# EAGLE schematic Main_Board_Rev_A2 (EAGLE 7.7.0)

## Sheet 1 of 6: Ethernet&CAN
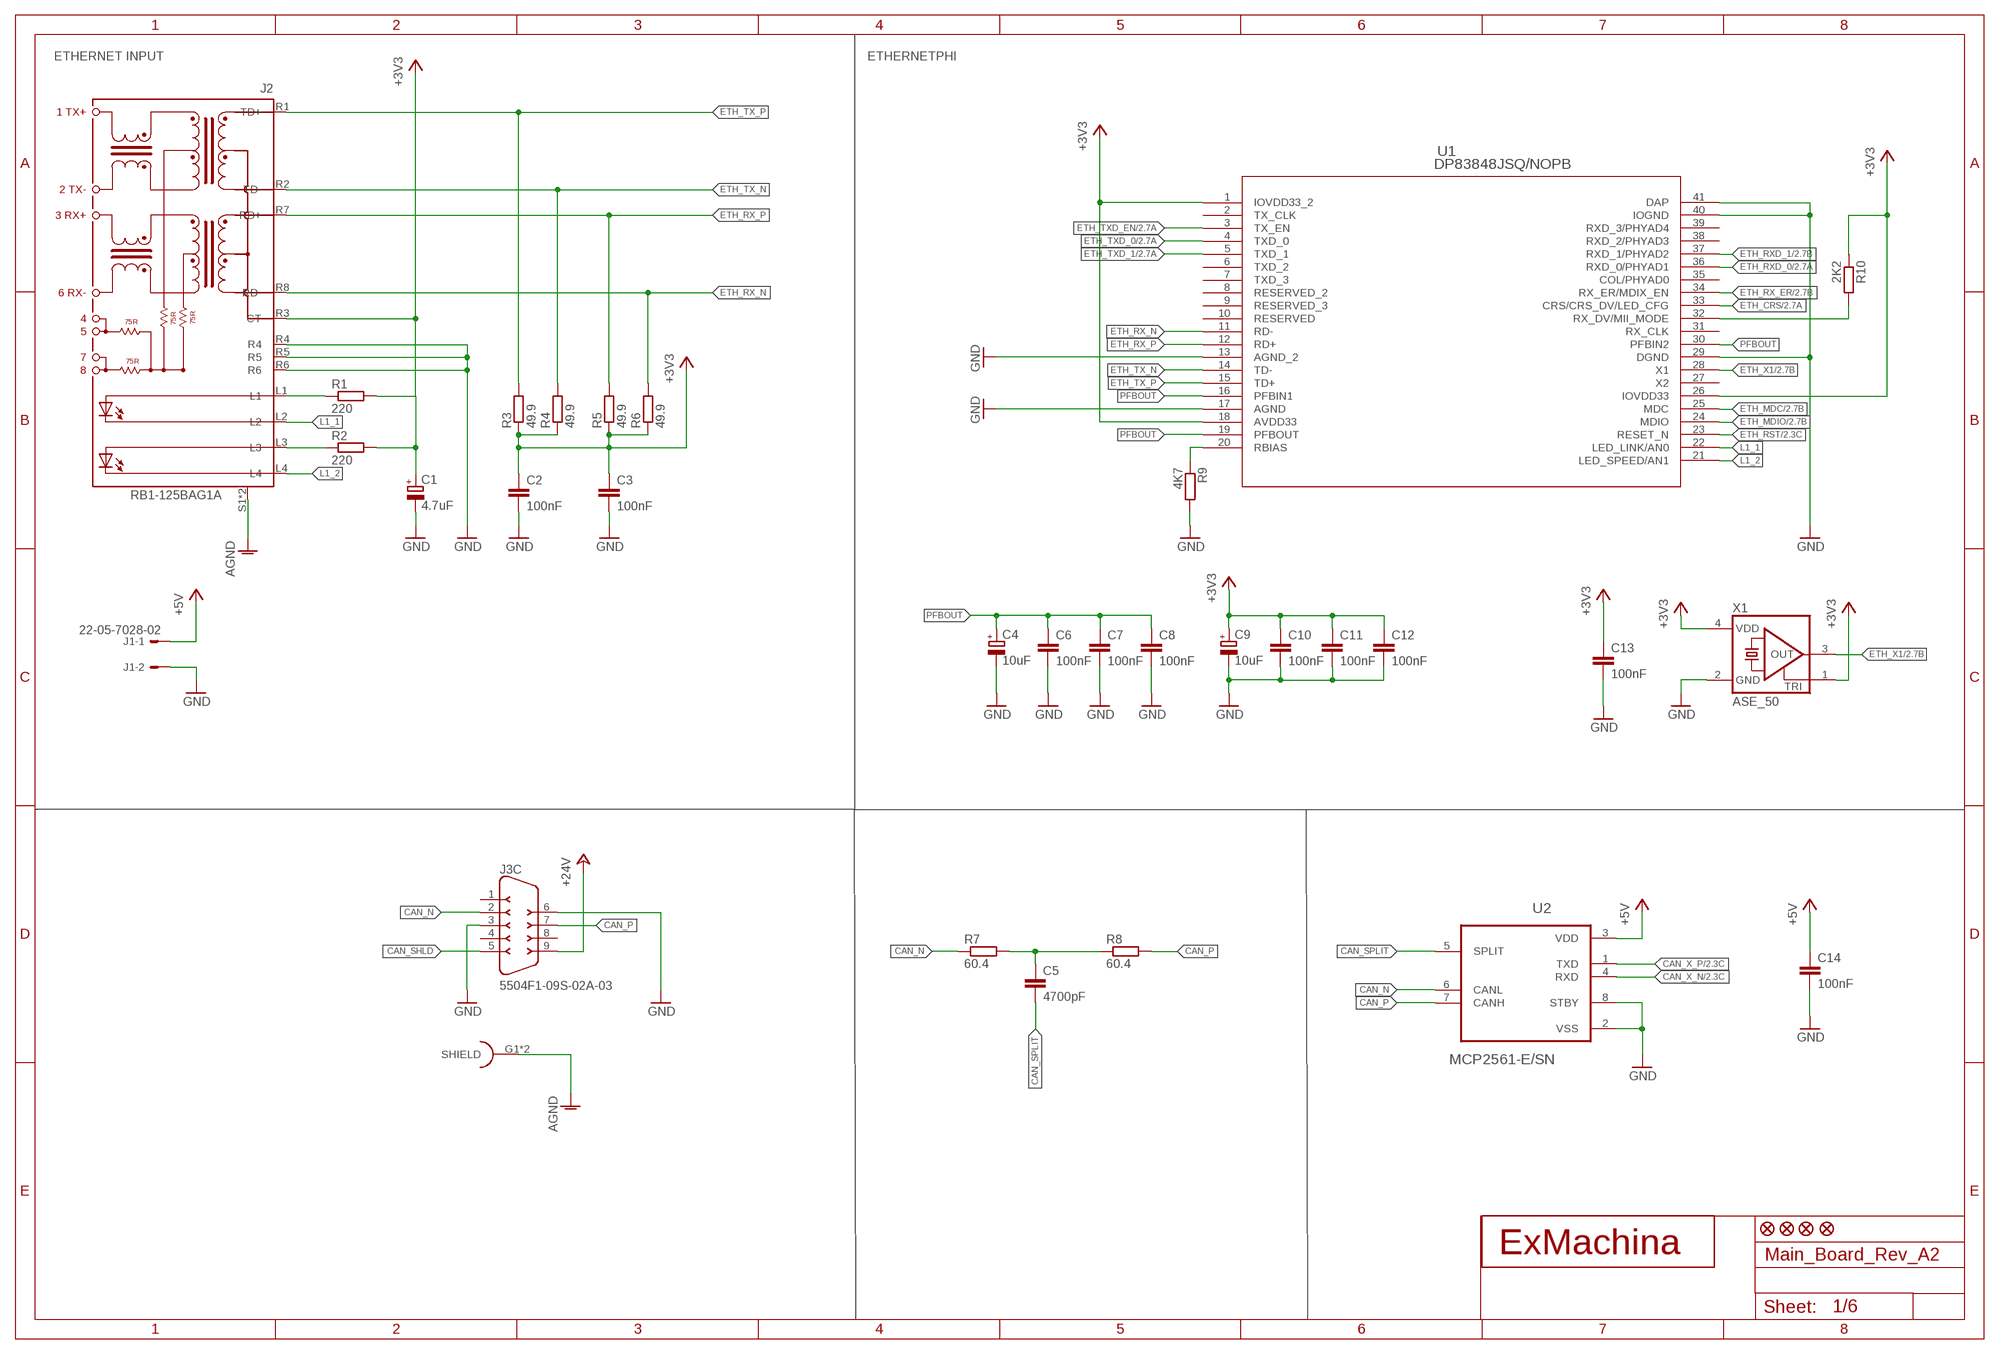
[diagram p0: schematic, sheet 1]

### Parts
C1  4.7uF  CPOL-EUCT3216  [CT3216]
C2  100nF  C-EUC0603  [C0603]
C3  100nF  C-EUC0603  [C0603]
C4  10uF  CPOL-EUCT3216  [CT3216]
C5  4700pF  C-EUC0603  [C0603]
C6  100nF  C-EUC0603  [C0603]
C7  100nF  C-EUC0603  [C0603]
C8  100nF  C-EUC0603  [C0603]
C9  10uF  CPOL-EUCT3216  [CT3216]
C10  100nF  C-EUC0603  [C0603]
C11  100nF  C-EUC0603  [C0603]
C12  100nF  C-EUC0603  [C0603]
C13  100nF  C-EUC0603  [C0603]
C14  100nF  C-EUC0603  [C0603]
J1  22-05-7028-02  [7395-02]
J2  RB1-125BAG1A  [WIZNET_RB1-125BAG1A]
J3  5504F1-09S-02A-03  [5504F1-09S-02A]
JP1  FIDUCIAL1X2  [FIDUCIAL-1X2]
JP2  FIDUCIAL1X2  [FIDUCIAL-1X2]
JP3  FIDUCIAL1X2  [FIDUCIAL-1X2]
JP4  FIDUCIAL1X2  [FIDUCIAL-1X2]
R1  220  R-EU_R0603  [R0603]
R2  220  R-EU_R0603  [R0603]
R3  49.9  R-EU_R0603  [R0603]
R4  49.9  R-EU_R0603  [R0603]
R5  49.9  R-EU_R0603  [R0603]
R6  49.9  R-EU_R0603  [R0603]
R7  60.4  R-EU_R0603  [R0603]
R8  60.4  R-EU_R0603  [R0603]
R9  4K7  R-EU_R0603  [R0603]
R10  2K2  R-EU_R0603  [R0603]
T1  EXMACHINA-LOGO-NAME  [EXM-LOGO-BASELINE]
U1  DP83848JSQ/NOPB  [SQA40B]
U2  MCP2561-E/SN  [SOIC127P600X175-8N]
X1  ASE_50  ASE  [ASE]

### Nets
+3V3 [supply]: C1.+ C2.1 C3.1 C9.+ C10.1 C11.1 C12.1 C13.1 J2.R3(CT) R1.2 R2.2 R3.1 R4.1 R5.1 R6.1 R10.1 U1.1(IOVDD33_2) U1.18(AVDD33) U1.26(IOVDD33) X1.1(TRI) X1.4(VDD) ; also sheet 2,3,4,5,6
+5V [supply]: C14.1 J1.1 U2.3(VDD) ; also sheet 3,4,5
+24V: J3.9 ; also sheet 3,5
AGND: J2.S1 J2.S2 J3.G1(S:SHIELD) J3.G2(S:SHIELD) ; also sheet 3,5,6
CAN_N [signal]: J3.2 R7.1 U2.6(CANL)
CAN_P [signal]: J3.7 R8.2 U2.7(CANH)
CAN_SHLD: J3.5
CAN_SPLIT [signal]: C5.2 U2.5(SPLIT)
CAN_X_N [signal]: U2.4(RXD) ; also sheet 2
CAN_X_P [signal]: U2.1(TXD) ; also sheet 2
ETH_CRS [signal]: U1.33(CRS/CRS_DV/LED_CFG) ; also sheet 2
ETH_MDC [signal]: U1.25(MDC) ; also sheet 2
ETH_MDIO [signal]: U1.24(MDIO) ; also sheet 2
ETH_RST [signal]: U1.23(RESET_N) ; also sheet 2
ETH_RX_ER [signal]: U1.34(RX_ER/MDIX_EN) ; also sheet 2
ETH_RX_N [signal]: J2.R8(RD-) R6.2 U1.11(RD-)
ETH_RX_P [signal]: J2.R7(RD+) R5.2 U1.12(RD+)
ETH_RXD_0 [signal]: U1.36(RXD_0/PHYAD1) ; also sheet 2
ETH_RXD_1 [signal]: U1.37(RXD_1/PHYAD2) ; also sheet 2
ETH_TX_N [signal]: J2.R2(TD-) R4.2 U1.14(TD-)
ETH_TX_P [signal]: J2.R1(TD+) R3.2 U1.15(TD+)
ETH_TXD_0 [signal]: U1.4(TXD_0) ; also sheet 2
ETH_TXD_1 [signal]: U1.5(TXD_1) ; also sheet 2
ETH_TXD_EN [signal]: U1.3(TX_EN) ; also sheet 2
ETH_X1 [signal]: U1.28(X1) X1.3(OUT) ; also sheet 2
GND [supply]: C1.- C2.2 C3.2 C4.- C6.2 C7.2 C8.2 C9.- C10.2 C11.2 C12.2 C13.2 C14.2 J1.2 J2.R4 J2.R5 J2.R6 J3.3 J3.6 R9.2 U1.13(AGND_2) U1.17(AGND) U1.29(DGND) U1.40(IOGND) U1.41(DAP) U2.2(VSS) U2.8(STBY) X1.2(GND) ; also sheet 2,3,4,5,6
L1_1 [signal]: J2.L2 U1.22(LED_LINK/AN0)
L1_2 [signal]: J2.L4 U1.21(LED_SPEED/AN1)
MII_MODE [signal]: R10.2 U1.32(RX_DV/MII_MODE)
N$3: C5.1 R7.2 R8.1
N$4: R9.1 U1.20(RBIAS)
N$8 [signal]: J2.L1 R1.1
N$9 [signal]: J2.L3 R2.1
PFBOUT [signal]: C4.+ C6.1 C7.1 C8.1 U1.16(PFBIN1) U1.19(PFBOUT) U1.30(PFBIN2)
Unconnected: J3.1 J3.4 J3.8 U1.2(TX_CLK) U1.6(TXD_2) U1.7(TXD_3) U1.8(RESERVED_2) U1.9(RESERVED_3) U1.10(RESERVED) U1.27(X2) U1.31(RX_CLK) U1.35(COL/PHYAD0) U1.38(RXD_2/PHYAD3) U1.39(RXD_3/PHYAD4)

### Notes on the sheet
- ETHERNET INPUT | ETHERNETPHI

## Sheet 2 of 6: LPC1768 + EEPROM
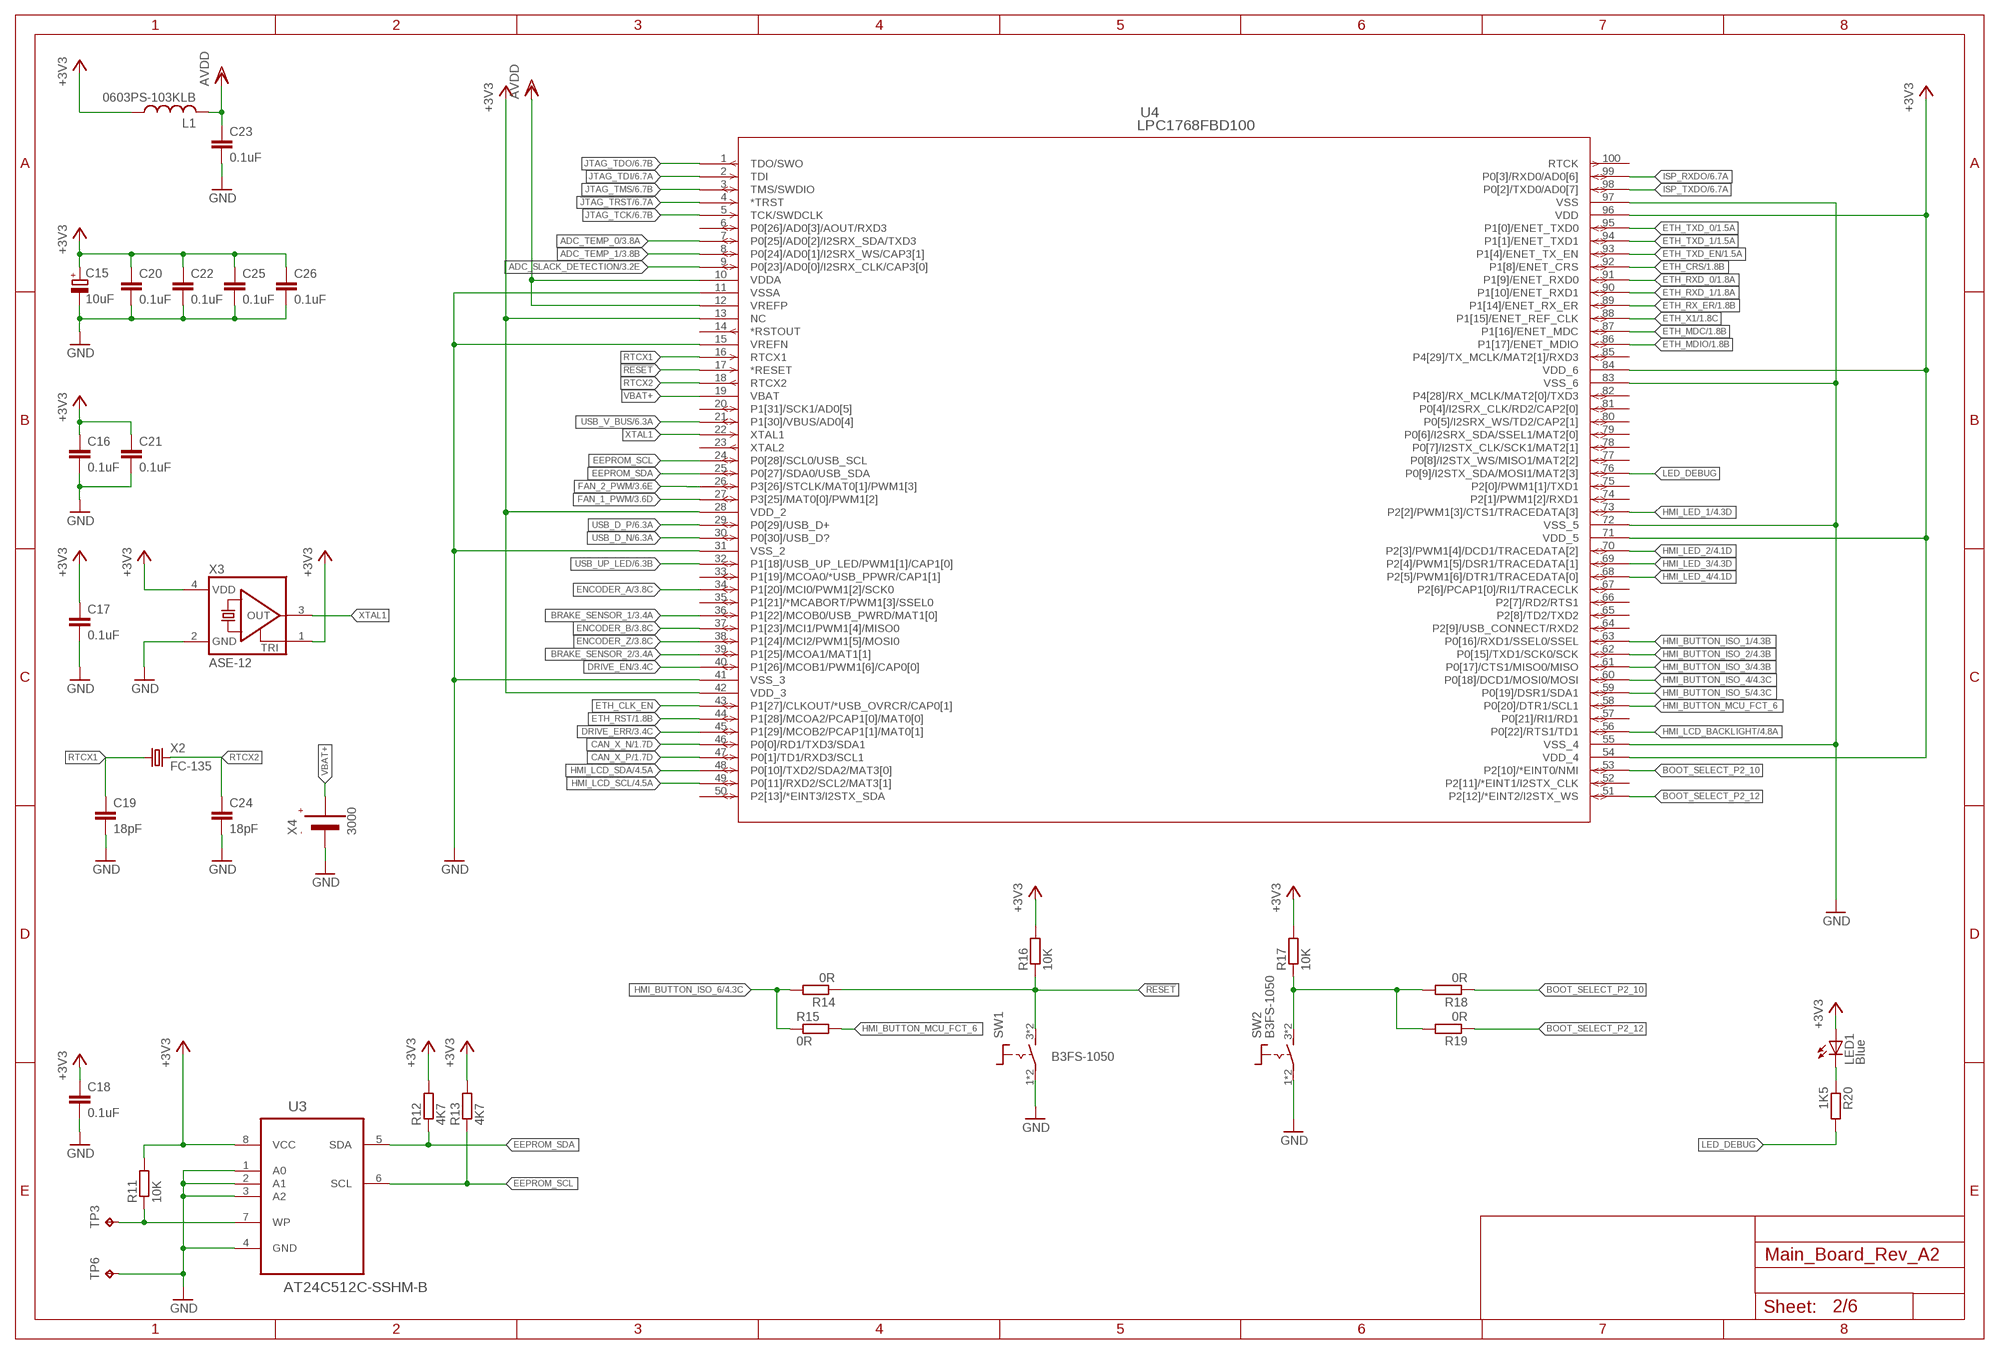
[diagram p1: schematic, sheet 2]

### Parts
C15  10uF  CPOL-EUCT3216  [CT3216]
C16  0.1uF  C-EUC0603  [C0603]
C17  0.1uF  C-EUC0603  [C0603]
C18  0.1uF  C-EUC0603  [C0603]
C19  18pF  C-EUC0603  [C0603]
C20  0.1uF  C-EUC0603  [C0603]
C21  0.1uF  C-EUC0603  [C0603]
C22  0.1uF  C-EUC0603  [C0603]
C23  0.1uF  C-EUC0603  [C0603]
C24  18pF  C-EUC0603  [C0603]
C25  0.1uF  C-EUC0603  [C0603]
C26  0.1uF  C-EUC0603  [C0603]
L1  0603PS-103KLB  0603PS  [0603]
LED1  Blue  LEDCHIPLED_0603  [CHIPLED_0603]
R11  10K  R-EU_R0603  [R0603]
R12  4K7  R-EU_R0603  [R0603]
R13  4K7  R-EU_R0603  [R0603]
R14  0R  R-EU_R0603  [R0603]
R15  0R  R-EU_R0603  [R0603]
R16  10K  R-EU_R0603  [R0603]
R17  10K  R-EU_R0603  [R0603]
R18  0R  R-EU_R0603  [R0603]
R19  0R  R-EU_R0603  [R0603]
R20  1K5  R-EU_R0603  [R0603]
SW1  B3FS-1050  [B3FS]
SW2  B3FS-1050  [B3FS]
TP3  TPB1,27  [B1,27]
TP6  TPB1,27  [B1,27]
U3  AT24C512C-SSHM-B  [SOIC127P600X175-8N]
U4  LPC1768FBD100  [SOT407-1]
X2  FC-135  [FC-135]
X3  ASE-12  ASE  [ASE]
X4  3000  [3000]

### Nets
!JTAG_TRST: U4.4(*TRST) ; also sheet 6
!RESET: R14.1 R16.1 SW1.3 SW1.4 U4.17(*RESET)
+3V3 [supply]: C15.+ C16.1 C17.1 C18.1 C20.1 C21.1 C22.1 C25.1 C26.1 L1.P$1 LED1.A R11.2 R12.2 R13.2 R16.2 R17.2 U3.8(VCC) U4.13(NC) U4.28(VDD_2) U4.42(VDD_3) U4.54(VDD_4) U4.71(VDD_5) U4.84(VDD_6) U4.96(VDD) X3.1(TRI) X3.4(VDD) ; also sheet 1,3,4,5,6
ADC_SLACK_DETECTION [signal]: U4.9(P0[23]/AD0[0]/I2SRX_CLK/CAP3[0]) ; also sheet 3
ADC_TEMP_0 [signal]: U4.7(P0[25]/AD0[2]/I2SRX_SDA/TXD3) ; also sheet 3
ADC_TEMP_1 [signal]: U4.8(P0[24]/AD0[1]/I2SRX_WS/CAP3[1]) ; also sheet 3
AVDD: C23.1 L1.P$2 U4.10(VDDA) U4.12(VREFP) ; also sheet 3
BOOT_SELECT_P2_10 [signal]: R18.1 U4.53(P2[10]/*EINT0/NMI)
BOOT_SELECT_P2_12 [signal]: R19.1 U4.51(P2[12]/*EINT2/I2STX_WS)
BRAKE_SENSOR_1: U4.36(P1[22]/MCOB0/USB_PWRD/MAT1[0]) ; also sheet 3
BRAKE_SENSOR_2: U4.39(P1[25]/MCOA1/MAT1[1]) ; also sheet 3
CAN_X_N [signal]: U4.46(P0[0]/RD1/TXD3/SDA1) ; also sheet 1
CAN_X_P [signal]: U4.47(P0[1]/TD1/RXD3/SCL1) ; also sheet 1
DRIVE_EN: U4.40(P1[26]/MCOB1/PWM1[6]/CAP0[0]) ; also sheet 3
DRIVE_ERR: U4.45(P1[29]/MCOB2/PCAP1[1]/MAT0[1]) ; also sheet 3
EEPROM_SCL: R13.1 U3.6(SCL) U4.24(P0[28]/SCL0/USB_SCL)
EEPROM_SDA: R12.1 U3.5(SDA) U4.25(P0[27]/SDA0/USB_SDA)
ENCODER_A: U4.34(P1[20]/MCI0/PWM1[2]/SCK0) ; also sheet 3
ENCODER_B: U4.37(P1[23]/MCI1/PWM1[4]/MISO0) ; also sheet 3
ENCODER_Z: U4.38(P1[24]/MCI2/PWM1[5]/MOSI0) ; also sheet 3
ETH_CLK_EN [signal]: U4.43(P1[27]/CLKOUT/*USB_OVRCR/CAP0[1])
ETH_CRS [signal]: U4.92(P1[8]/ENET_CRS) ; also sheet 1
ETH_MDC [signal]: U4.87(P1[16]/ENET_MDC) ; also sheet 1
ETH_MDIO [signal]: U4.86(P1[17]/ENET_MDIO) ; also sheet 1
ETH_RST [signal]: U4.44(P1[28]/MCOA2/PCAP1[0]/MAT0[0]) ; also sheet 1
ETH_RX_ER [signal]: U4.89(P1[14]/ENET_RX_ER) ; also sheet 1
ETH_RXD_0 [signal]: U4.91(P1[9]/ENET_RXD0) ; also sheet 1
ETH_RXD_1 [signal]: U4.90(P1[10]/ENET_RXD1) ; also sheet 1
ETH_TXD_0 [signal]: U4.95(P1[0]/ENET_TXD0) ; also sheet 1
ETH_TXD_1 [signal]: U4.94(P1[1]/ENET_TXD1) ; also sheet 1
ETH_TXD_EN [signal]: U4.93(P1[4]/ENET_TX_EN) ; also sheet 1
ETH_X1 [signal]: U4.88(P1[15]/ENET_REF_CLK) ; also sheet 1
FAN_1_PWM [signal]: U4.27(P3[25]/MAT0[0]/PWM1[2]) ; also sheet 3
FAN_2_PWM [signal]: U4.26(P3[26]/STCLK/MAT0[1]/PWM1[3]) ; also sheet 3
GND [supply]: C15.- C16.2 C17.2 C18.2 C19.2 C20.2 C21.2 C22.2 C23.2 C24.2 C25.2 C26.2 SW1.1 SW1.2 SW2.1 SW2.2 TP6.TP U3.1(A0) U3.2(A1) U3.3(A2) U3.4(GND) U4.11(VSSA) U4.15(VREFN) U4.31(VSS_2) U4.41(VSS_3) U4.55(VSS_4) U4.72(VSS_5) U4.83(VSS_6) U4.97(VSS) X3.2(GND) X4.-(VBAT-) ; also sheet 1,3,4,5,6
HMI_BUTTON_ISO_1: U4.63(P0[16]/RXD1/SSEL0/SSEL) ; also sheet 4
HMI_BUTTON_ISO_2: U4.62(P0[15]/TXD1/SCK0/SCK) ; also sheet 4
HMI_BUTTON_ISO_3: U4.61(P0[17]/CTS1/MISO0/MISO) ; also sheet 4
HMI_BUTTON_ISO_4: U4.60(P0[18]/DCD1/MOSI0/MOSI) ; also sheet 4
HMI_BUTTON_ISO_5: U4.59(P0[19]/DSR1/SDA1) ; also sheet 4
HMI_BUTTON_ISO_6: R14.2 R15.1 ; also sheet 4
HMI_BUTTON_MCU_FCT_6: R15.2 U4.58(P0[20]/DTR1/SCL1)
HMI_LCD_BACKLIGHT: U4.56(P0[22]/RTS1/TD1) ; also sheet 4
HMI_LCD_SCL [signal]: U4.49(P0[11]/RXD2/SCL2/MAT3[1]) ; also sheet 4
HMI_LCD_SDA [signal]: U4.48(P0[10]/TXD2/SDA2/MAT3[0]) ; also sheet 4
HMI_LED_1 [signal]: U4.73(P2[2]/PWM1[3]/CTS1/TRACEDATA[3]) ; also sheet 4
HMI_LED_2 [signal]: U4.70(P2[3]/PWM1[4]/DCD1/TRACEDATA[2]) ; also sheet 4
HMI_LED_3 [signal]: U4.69(P2[4]/PWM1[5]/DSR1/TRACEDATA[1]) ; also sheet 4
HMI_LED_4 [signal]: U4.68(P2[5]/PWM1[6]/DTR1/TRACEDATA[0]) ; also sheet 4
ISP_RXDO [signal]: U4.99(P0[3]/RXD0/AD0[6]) ; also sheet 6
ISP_TXDO [signal]: U4.98(P0[2]/TXD0/AD0[7]) ; also sheet 6
JTAG_TCK [signal]: U4.5(TCK/SWDCLK) ; also sheet 6
JTAG_TDI [signal]: U4.2(TDI) ; also sheet 6
JTAG_TDO [signal]: U4.1(TDO/SWO) ; also sheet 6
JTAG_TMS [signal]: U4.3(TMS/SWDIO) ; also sheet 6
LED_DEBUG [signal]: R20.2 U4.76(P0[9]/I2STX_SDA/MOSI1/MAT2[3])
N$47: R11.1 TP3.TP U3.7(WP)
N$48 [signal]: R17.1 R18.2 R19.2 SW2.3 SW2.4
N$49 [signal]: LED1.C R20.1
RTCX1: C19.1 U4.16(RTCX1) X2.1
RTCX2: C24.1 U4.18(RTCX2) X2.2
USB_D_N: U4.30(P0[30]/USB_D?) ; also sheet 6
USB_D_P [signal]: U4.29(P0[29]/USB_D+) ; also sheet 6
USB_UP_LED [signal]: U4.32(P1[18]/USB_UP_LED/PWM1[1]/CAP1[0]) ; also sheet 6
USB_V_BUS [signal]: U4.21(P1[30]/VBUS/AD0[4]) ; also sheet 6
VBAT+: U4.19(VBAT) X4.+1(VBAT+) X4.+2(VBAT+)
XTAL1: U4.22(XTAL1) X3.3(OUT)
Unconnected: U4.6(P0[26]/AD0[3]/AOUT/RXD3) U4.14(*RSTOUT) U4.20(P1[31]/SCK1/AD0[5]) U4.23(XTAL2) U4.33(P1[19]/MCOA0/*USB_PPWR/CAP1[1]) U4.35(P1[21]/*MCABORT/PWM1[3]/SSEL0) U4.50(P2[13]/*EINT3/I2STX_SDA) U4.52(P2[11]/*EINT1/I2STX_CLK) U4.57(P0[21]/RI1/RD1) U4.64(P2[9]/USB_CONNECT/RXD2) U4.65(P2[8]/TD2/TXD2) U4.66(P2[7]/RD2/RTS1) U4.67(P2[6]/PCAP1[0]/RI1/TRACECLK) U4.74(P2[1]/PWM1[2]/RXD1) U4.75(P2[0]/PWM1[1]/TXD1) U4.77(P0[8]/I2STX_WS/MISO1/MAT2[2]) U4.78(P0[7]/I2STX_CLK/SCK1/MAT2[1]) U4.79(P0[6]/I2SRX_SDA/SSEL1/MAT2[0]) U4.80(P0[5]/I2SRX_WS/TD2/CAP2[1]) U4.81(P0[4]/I2SRX_CLK/RD2/CAP2[0]) U4.82(P4[28]/RX_MCLK/MAT2[0]/TXD3) U4.85(P4[29]/TX_MCLK/MAT2[1]/RXD3) U4.100(RTCK)

## Sheet 3 of 6: Motor Sensors
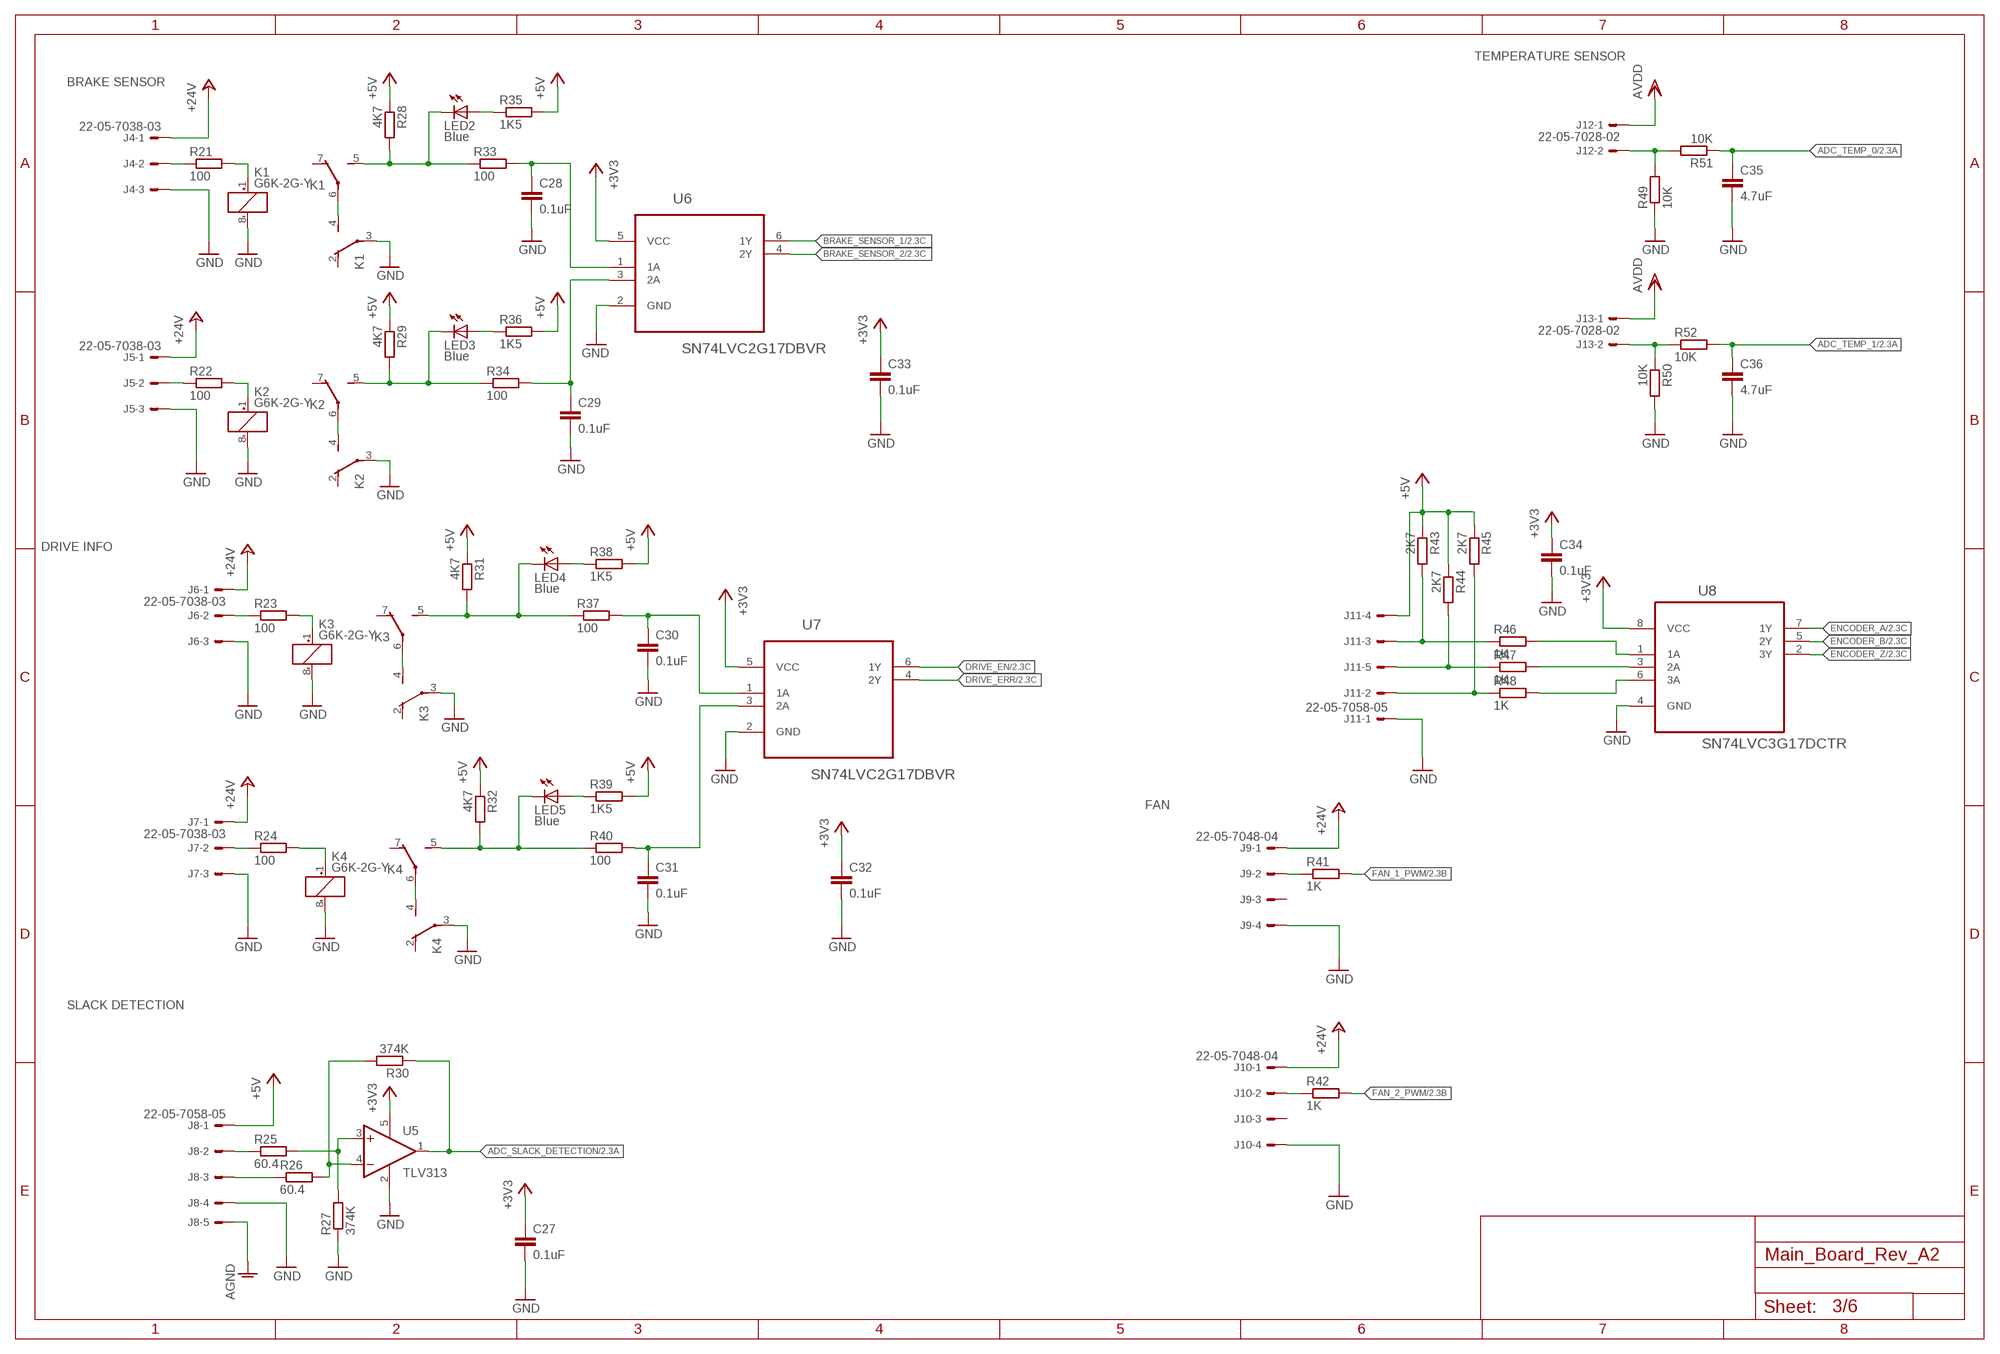
[diagram p2: schematic, sheet 3]

### Parts
C27  0.1uF  C-EUC0603  [C0603]
C28  0.1uF  C-EUC0603  [C0603]
C29  0.1uF  C-EUC0603  [C0603]
C30  0.1uF  C-EUC0603  [C0603]
C31  0.1uF  C-EUC0603  [C0603]
C32  0.1uF  C-EUC0603  [C0603]
C33  0.1uF  C-EUC0603  [C0603]
C34  0.1uF  C-EUC0603  [C0603]
C35  4.7uF  C-EUC0603  [C0603]
C36  4.7uF  C-EUC0603  [C0603]
J4  22-05-7038-03  [7395-03]
J5  22-05-7038-03  [7395-03]
J6  22-05-7038-03  [7395-03]
J7  22-05-7038-03  [7395-03]
J8  22-05-7058-05  [7395-05]
J9  22-05-7048-04  [7395-04]
J10  22-05-7048-04  [7395-04]
J11  22-05-7058-05  [7395-05]
J12  22-05-7028-02  [7395-02]
J13  22-05-7028-02  [7395-02]
K1  G6K-2G-Y  [G6K-2G-Y]
K2  G6K-2G-Y  [G6K-2G-Y]
K3  G6K-2G-Y  [G6K-2G-Y]
K4  G6K-2G-Y  [G6K-2G-Y]
LED2  Blue  LEDCHIPLED_0603  [CHIPLED_0603]
LED3  Blue  LEDCHIPLED_0603  [CHIPLED_0603]
LED4  Blue  LEDCHIPLED_0603  [CHIPLED_0603]
LED5  Blue  LEDCHIPLED_0603  [CHIPLED_0603]
R21  100  R-EU_R0603  [R0603]
R22  100  R-EU_R0603  [R0603]
R23  100  R-EU_R0603  [R0603]
R24  100  R-EU_R0603  [R0603]
R25  60.4  R-EU_R0603  [R0603]
R26  60.4  R-EU_R0603  [R0603]
R27  374K  R-EU_R0603  [R0603]
R28  4K7  R-EU_R0603  [R0603]
R29  4K7  R-EU_R0603  [R0603]
R30  374K  R-EU_R0603  [R0603]
R31  4K7  R-EU_R0603  [R0603]
R32  4K7  R-EU_R0603  [R0603]
R33  100  R-EU_R0603  [R0603]
R34  100  R-EU_R0603  [R0603]
R35  1K5  R-EU_R0603  [R0603]
R36  1K5  R-EU_R0603  [R0603]
R37  100  R-EU_R0603  [R0603]
R38  1K5  R-EU_R0603  [R0603]
R39  1K5  R-EU_R0603  [R0603]
R40  100  R-EU_R0603  [R0603]
R41  1K  R-EU_R0603  [R0603]
R42  1K  R-EU_R0603  [R0603]
R43  2K7  R-EU_R0603  [R0603]
R44  2K7  R-EU_R0603  [R0603]
R45  2K7  R-EU_R0603  [R0603]
R46  1K  R-EU_R0603  [R0603]
R47  1K  R-EU_R0603  [R0603]
R48  1K  R-EU_R0603  [R0603]
R49  10K  R-EU_R0603  [R0603]
R50  10K  R-EU_R0603  [R0603]
R51  10K  R-EU_R0603  [R0603]
R52  10K  R-EU_R0603  [R0603]
U5  TLV313  [SOT23-DBV]
U6  SN74LVC2G17DBVR  [SOT95P280X145-6N]
U7  SN74LVC2G17DBVR  [SOT95P280X145-6N]
U8  SN74LVC3G17DCTR  [SOP65P400X130-8N]

### Nets
+3V3 [supply]: C27.1 C32.1 C33.1 C34.1 U5.5(V+) U6.5(VCC) U7.5(VCC) U8.8(VCC) ; also sheet 1,2,4,5,6
+5V [supply]: J8.1 J11.4 R28.1 R29.1 R31.1 R32.1 R35.2 R36.2 R38.2 R39.2 R43.1 R44.1 R45.1 ; also sheet 1,4,5
+24V: J4.1 J5.1 J6.1 J7.1 J9.1 J10.1 ; also sheet 1,5
ADC_SLACK_DETECTION [signal]: R30.1 U5.1(OUT) ; also sheet 2
ADC_TEMP_0 [signal]: C35.1 R51.1 ; also sheet 2
ADC_TEMP_1 [signal]: C36.1 R52.2 ; also sheet 2
AGND: J8.5 ; also sheet 1,5,6
AVDD: J12.1 J13.1 ; also sheet 2
BRAKE_SENSOR_1: U6.6(1Y) ; also sheet 2
BRAKE_SENSOR_2: U6.4(2Y) ; also sheet 2
DRIVE_EN: U7.6(1Y) ; also sheet 2
DRIVE_ERR: U7.4(2Y) ; also sheet 2
ENCODER_A: U8.7(1Y) ; also sheet 2
ENCODER_B: U8.5(2Y) ; also sheet 2
ENCODER_Z: U8.2(3Y) ; also sheet 2
FAN_1_PWM [signal]: R41.2 ; also sheet 2
FAN_2_PWM [signal]: R42.2 ; also sheet 2
GND [supply]: C27.2 C28.2 C29.2 C30.2 C31.2 C32.2 C33.2 C34.2 C35.2 C36.2 J4.3 J5.3 J6.3 J7.3 J8.4 J9.4 J10.4 J11.1 K1.3(2:P) K1.8(1:-) K2.3(2:P) K2.8(1:-) K3.3(2:P) K3.8(1:-) K4.3(2:P) K4.8(1:-) R27.1 R49.1 R50.2 U5.2(V-) U6.2(GND) U7.2(GND) U8.4(GND) ; also sheet 1,2,4,5,6
N$11 [signal]: J9.2 R41.1
N$12: J11.3 R43.2 R46.1
N$13 [signal]: J10.2 R42.1
N$14: J11.5 R44.2 R47.1
N$21: J4.2 R21.1
N$23: J5.2 R22.1
N$24: K1.1(1:+) R21.2
N$28: K3.1(1:+) R23.2
N$29: K1.4(2:S) K1.6(3:P)
N$32: J6.2 R23.1
N$33: K4.1(1:+) R24.2
N$37: J7.2 R24.1
N$38: C29.1 R34.2 U6.3(2A)
N$39: C28.1 R33.2 U6.1(1A)
N$41: C30.1 R37.2 U7.1(1A)
N$42: C31.1 R40.2 U7.3(2A)
N$52: J11.2 R45.2 R48.1
N$53: R48.2 U8.6(3A)
N$54: R47.2 U8.3(2A)
N$55: K2.1(1:+) R22.2
N$57: K2.4(2:S) K2.6(3:P)
N$58: K1.5(3:S) LED2.C R28.2 R33.1
N$59: K4.4(2:S) K4.6(3:P)
N$60: K3.4(2:S) K3.6(3:P)
N$61: R46.2 U8.1(1A)
N$62: J8.2 R25.1
N$65: J12.2 R49.2 R51.2
N$66: J13.2 R50.1 R52.1
N$70: LED2.A R35.1
N$71: K2.5(3:S) LED3.C R29.2 R34.1
N$72: LED3.A R36.1
N$73: K3.5(3:S) LED4.C R31.2 R37.1
N$74: LED4.A R38.1
N$75: K4.5(3:S) LED5.C R32.2 R40.1
N$76: LED5.A R39.1
N$78: J8.3 R26.1
N$79: R25.2 R27.2 U5.3(+IN)
N$80: R26.2 R30.2 U5.4(-IN)
Unconnected: J9.3 J10.3 K1.2(2:O) K1.7(3:O) K2.2(2:O) K2.7(3:O) K3.2(2:O) K3.7(3:O) K4.2(2:O) K4.7(3:O)

### Notes on the sheet
- TEMPERATURE SENSOR
- BRAKE SENSOR
- DRIVE INFO
- FAN
- SLACK DETECTION

## Sheet 4 of 6: HMI Interface
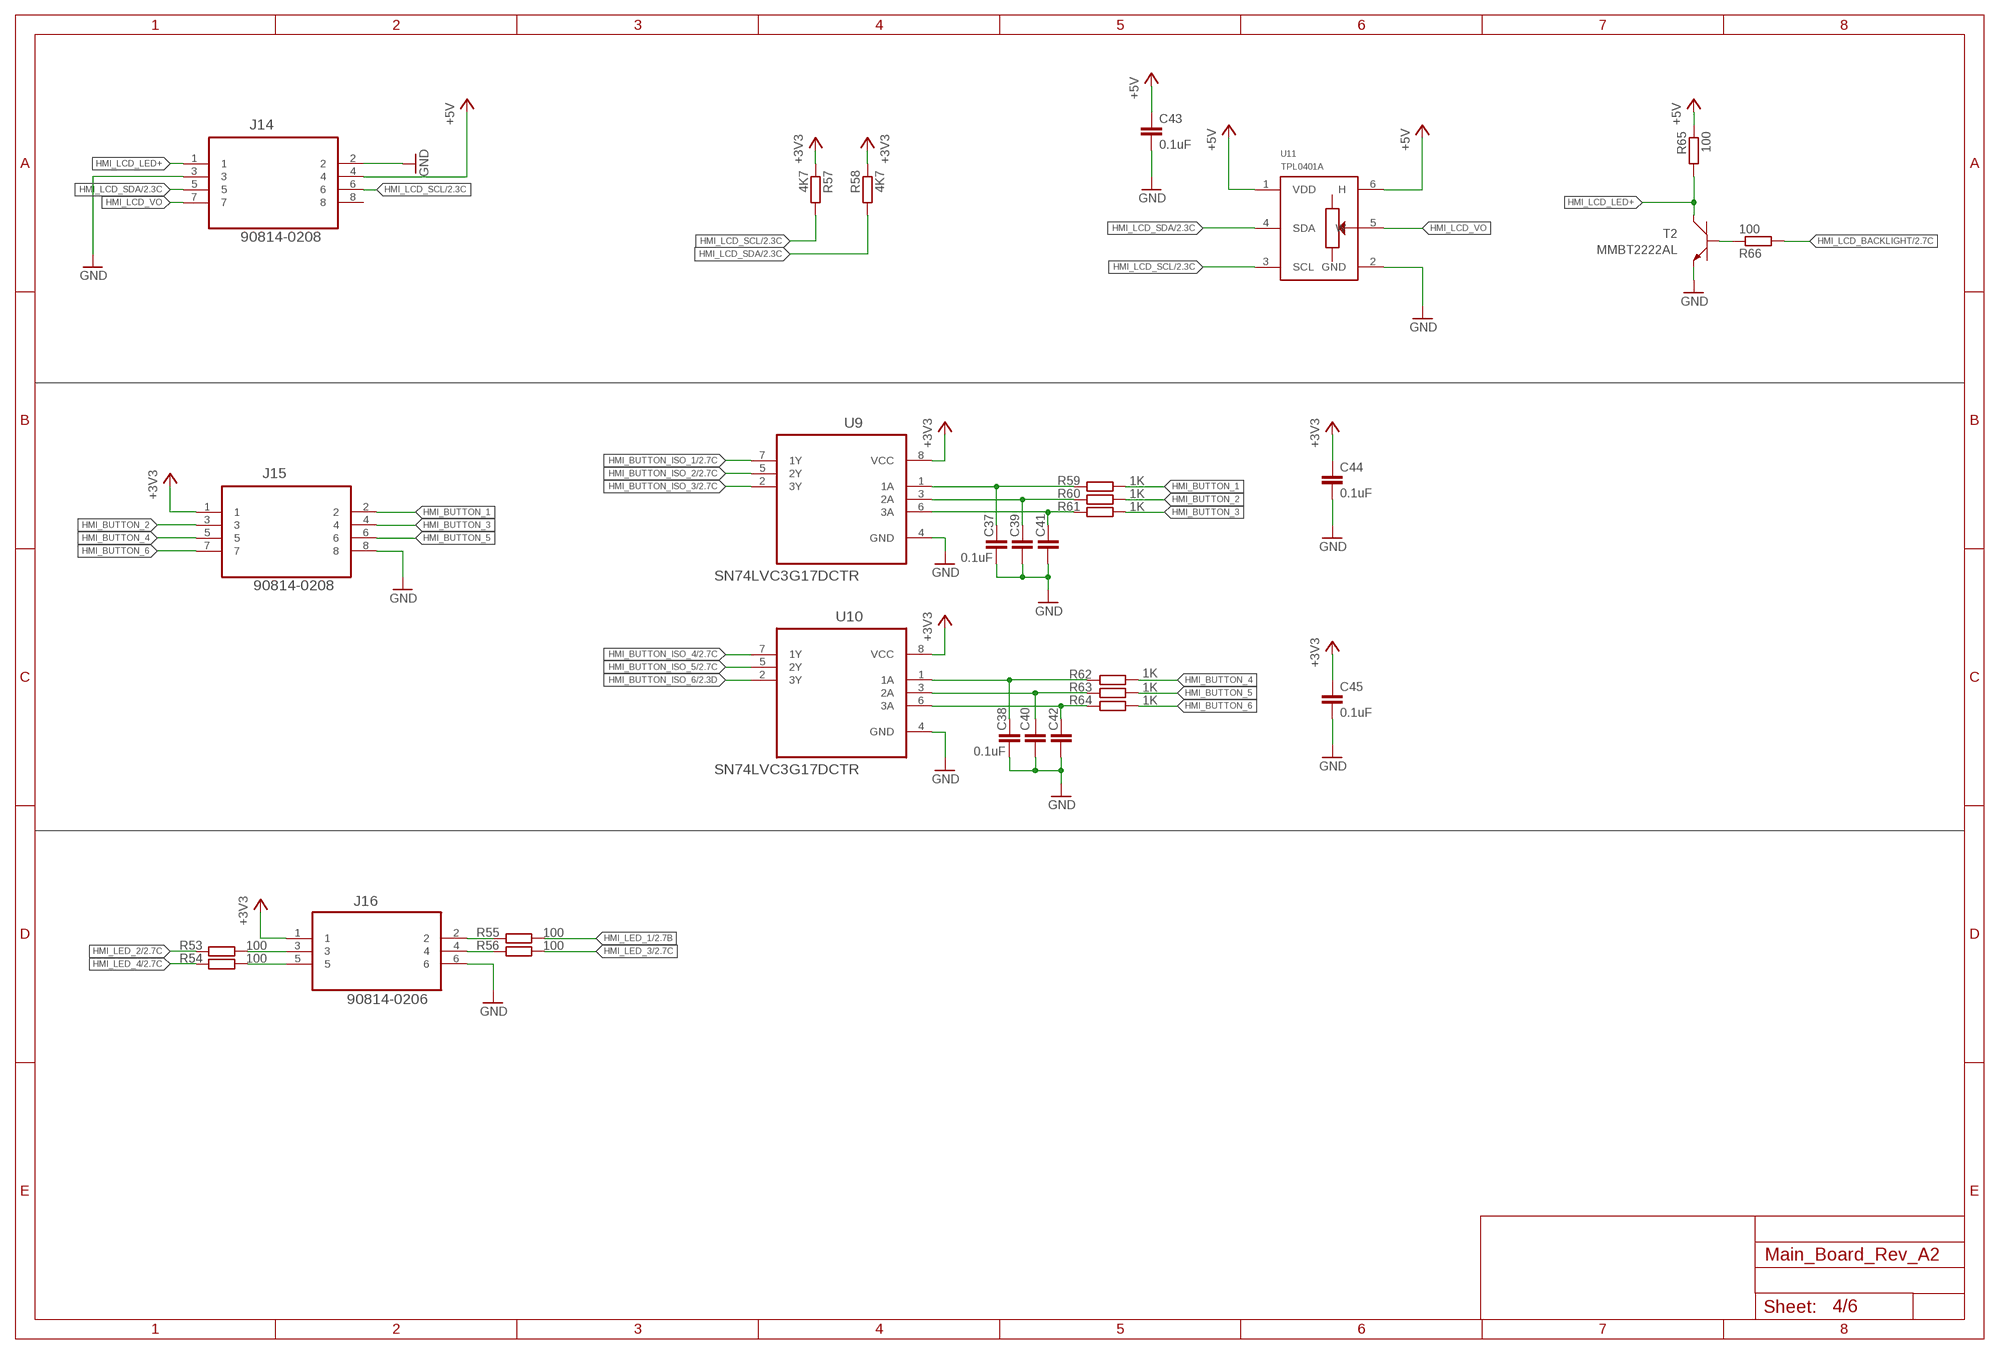
[diagram p3: schematic, sheet 4]

### Parts
C37  0.1uF  C-EUC0603  [C0603]
C38  0.1uF  C-EUC0603  [C0603]
C39  0.1uF  C-EUC0603  [C0603]
C40  0.1uF  C-EUC0603  [C0603]
C41  0.1uF  C-EUC0603  [C0603]
C42  0.1uF  C-EUC0603  [C0603]
C43  0.1uF  C-EUC0603  [C0603]
C44  0.1uF  C-EUC0603  [C0603]
C45  0.1uF  C-EUC0603  [C0603]
J14  90814-0208  [MOLEX_90814-0208]
J15  90814-0208  [MOLEX_90814-0208]
J16  90814-0206  [MOLEX_90814-0206]
R53  100  R-EU_R0603  [R0603]
R54  100  R-EU_R0603  [R0603]
R55  100  R-EU_R0603  [R0603]
R56  100  R-EU_R0603  [R0603]
R57  4K7  R-EU_R0603  [R0603]
R58  4K7  R-EU_R0603  [R0603]
R59  1K  R-EU_R0603  [R0603]
R60  1K  R-EU_R0603  [R0603]
R61  1K  R-EU_R0603  [R0603]
R62  1K  R-EU_R0603  [R0603]
R63  1K  R-EU_R0603  [R0603]
R64  1K  R-EU_R0603  [R0603]
R65  100  R-EU_R0603  [R0603]
R66  100  R-EU_R0603  [R0603]
T2  MMBT2222AL  [SOT−23]
U9  SN74LVC3G17DCTR  [SOP65P400X130-8N]
U10  SN74LVC3G17DCTR  [SOP65P400X130-8N]
U11  TPL0401A  [SC-70-DCK]

### Nets
+3V3 [supply]: C44.1 C45.1 J15.1 J16.1 R57.1 R58.1 U9.8(VCC) U10.8(VCC) ; also sheet 1,2,3,5,6
+5V [supply]: C43.1 J14.4 R65.1 U11.1(VDD) U11.6(H) ; also sheet 1,3,5
GND [supply]: C37.2 C38.2 C39.2 C40.2 C41.2 C42.2 C43.2 C44.2 C45.2 J14.2 J14.3 J15.8 J16.6 T2.2(E) U9.4(GND) U10.4(GND) U11.2(GND) ; also sheet 1,2,3,5,6
HMI_BUTTON_1 [signal]: J15.2 R59.1
HMI_BUTTON_2 [signal]: J15.3 R60.1
HMI_BUTTON_3 [signal]: J15.4 R61.1
HMI_BUTTON_4 [signal]: J15.5 R62.1
HMI_BUTTON_5 [signal]: J15.6 R63.1
HMI_BUTTON_6: J15.7 R64.1
HMI_BUTTON_ISO_1: U9.7(1Y) ; also sheet 2
HMI_BUTTON_ISO_2: U9.5(2Y) ; also sheet 2
HMI_BUTTON_ISO_3: U9.2(3Y) ; also sheet 2
HMI_BUTTON_ISO_4: U10.7(1Y) ; also sheet 2
HMI_BUTTON_ISO_5: U10.5(2Y) ; also sheet 2
HMI_BUTTON_ISO_6: U10.2(3Y) ; also sheet 2
HMI_LCD_BACKLIGHT: R66.2 ; also sheet 2
HMI_LCD_LED+: J14.1 R65.2 T2.3(C)
HMI_LCD_SCL [signal]: J14.6 R57.2 U11.3(SCL) ; also sheet 2
HMI_LCD_SDA [signal]: J14.5 R58.2 U11.4(SDA) ; also sheet 2
HMI_LCD_VO: J14.7 U11.5(W)
HMI_LED_1 [signal]: R55.1 ; also sheet 2
HMI_LED_2 [signal]: R53.2 ; also sheet 2
HMI_LED_3 [signal]: R56.1 ; also sheet 2
HMI_LED_4 [signal]: R54.2 ; also sheet 2
N$1: J16.3 R53.1
N$2: J16.5 R54.1
N$17: C37.1 R59.2 U9.1(1A)
N$19: C39.1 R60.2 U9.3(2A)
N$20: C41.1 R61.2 U9.6(3A)
N$25: C38.1 R62.2 U10.1(1A)
N$26: C40.1 R63.2 U10.3(2A)
N$27: C42.1 R64.2 U10.6(3A)
N$63: J16.2 R55.2
N$64: J16.4 R56.2
N$67: R66.1 T2.1(B)
Unconnected: J14.8

## Sheet 5 of 6: Power
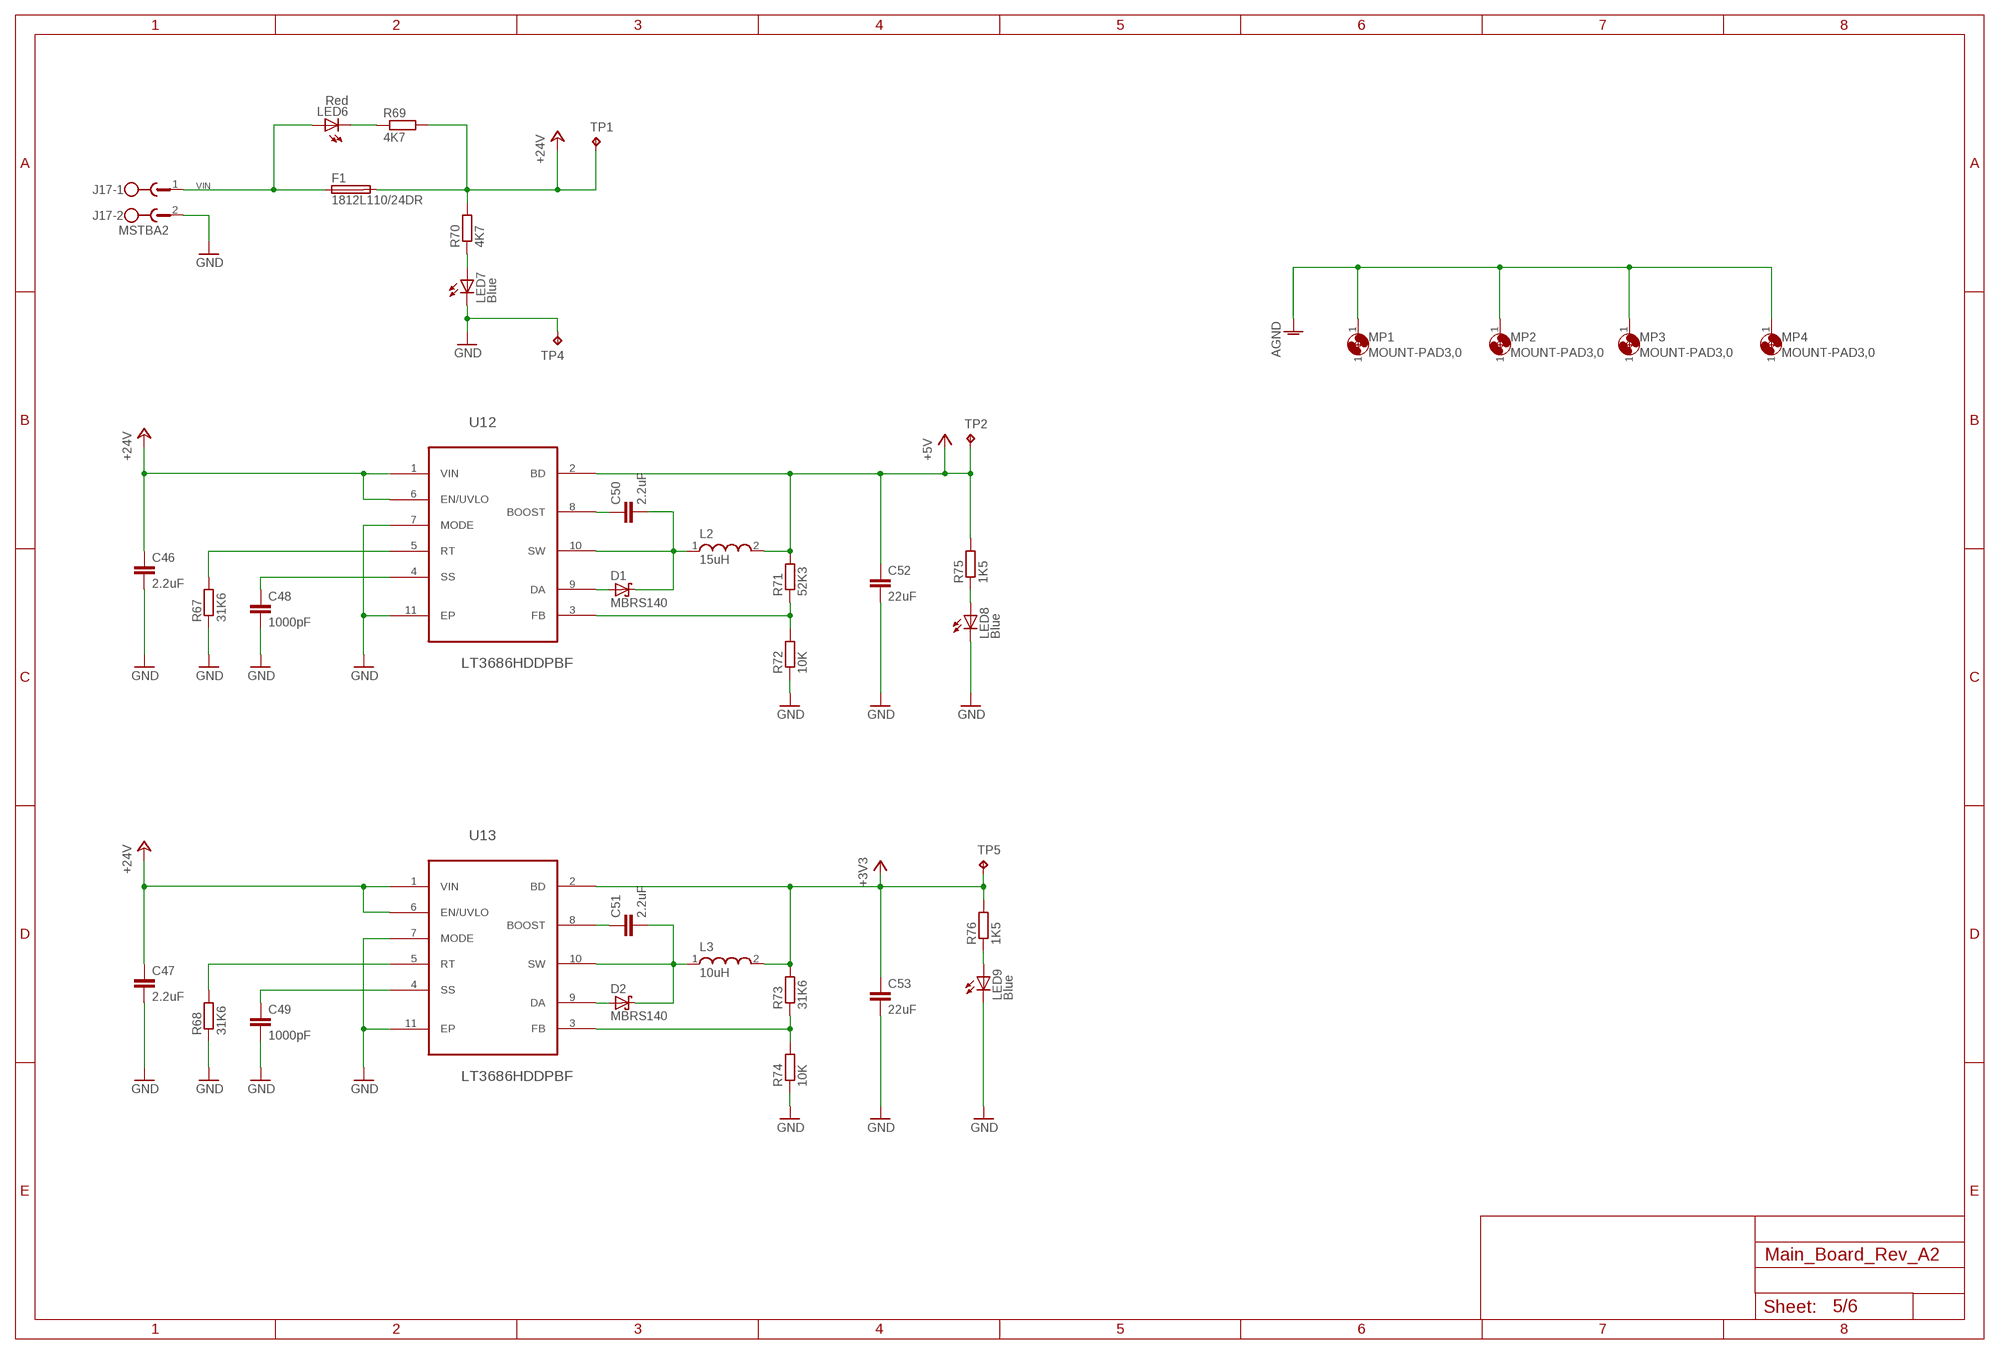
[diagram p4: schematic, sheet 5]

### Parts
C46  2.2uF  C-EUC0603  [C0603]
C47  2.2uF  C-EUC0603  [C0603]
C48  1000pF  C-EUC0603  [C0603]
C49  1000pF  C-EUC0603  [C0603]
C50  2.2uF  C-EUC0603  [C0603]
C51  2.2uF  C-EUC0603  [C0603]
C52  22uF  C-EUC0805  [C0805]
C53  22uF  C-EUC0805  [C0805]
D1  MBRS140  [DO-214AA]
D2  MBRS140  [DO-214AA]
F1  1812L110/24DR  [LITTLEFUSE_SMD]
J17  MSTBA2  [MSTBA2]
L2  15uH  WE-PD2_5848/5820  [WE-PD2_5848/5820]
L3  10uH  WE-PD2_5848/5820  [WE-PD2_5848/5820]
LED6  Red  LEDCHIPLED_0603  [CHIPLED_0603]
LED7  Blue  LEDCHIPLED_0603  [CHIPLED_0603]
LED8  Blue  LEDCHIPLED_0603  [CHIPLED_0603]
LED9  Blue  LEDCHIPLED_0603  [CHIPLED_0603]
MP1  MOUNT-PAD3,0  [P3,0]
MP2  MOUNT-PAD3,0  [P3,0]
MP3  MOUNT-PAD3,0  [P3,0]
MP4  MOUNT-PAD3,0  [P3,0]
R67  31K6  R-EU_R0603  [R0603]
R68  31K6  R-EU_R0603  [R0603]
R69  4K7  R-EU_R0603  [R0603]
R70  4K7  R-EU_R0603  [R0603]
R71  52K3  R-EU_R0603  [R0603]
R72  10K  R-EU_R0603  [R0603]
R73  31K6  R-EU_R0603  [R0603]
R74  10K  R-EU_R0603  [R0603]
R75  1K5  R-EU_R0603  [R0603]
R76  1K5  R-EU_R0603  [R0603]
TP1  TPB1,27  [B1,27]
TP2  TPB1,27  [B1,27]
TP4  TPB1,27  [B1,27]
TP5  TPB1,27  [B1,27]
U12  LT3686HDDPBF  [DFN300X300X80-11N]
U13  LT3686HDDPBF  [DFN300X300X80-11N]

### Nets
+3V3 [supply]: C53.1 L3.2 R73.2 R76.2 TP5.TP U13.2(BD) ; also sheet 1,2,3,4,6
+5V [supply]: C52.1 L2.2 R71.2 R75.2 TP2.TP U12.2(BD) ; also sheet 1,3,4
+24V: C46.1 C47.1 F1.2 R69.2 R70.2 TP1.TP U12.1(VIN) U12.6(EN/UVLO) U13.1(VIN) U13.6(EN/UVLO) ; also sheet 1,3
AGND: MP1.1 MP2.1 MP3.1 MP4.1 ; also sheet 1,3,6
GND [supply]: C46.2 C47.2 C48.2 C49.2 C52.2 C53.2 J17.2 LED7.C LED8.C LED9.C R67.1 R68.1 R72.1 R74.1 TP4.TP U12.7(MODE) U12.11(EP) U13.7(MODE) U13.11(EP) ; also sheet 1,2,3,4,6
N$5: R67.2 U12.5(RT)
N$6: C48.1 U12.4(SS)
N$10: R68.2 U13.5(RT)
N$22: C49.1 U13.4(SS)
N$30: R71.1 R72.2 U12.3(FB)
N$31: C50.1 U12.8(BOOST)
N$34: C50.2 D1.C L2.1 U12.10(SW)
N$35: D1.A U12.9(DA)
N$36: R73.1 R74.2 U13.3(FB)
N$40: C51.1 U13.8(BOOST)
N$43: C51.2 D2.C L3.1 U13.10(SW)
N$44: LED7.A R70.1
N$45: LED6.C R69.1
N$46: D2.A U13.9(DA)
N$50: LED9.A R76.1
N$51: LED8.A R75.1
VIN: F1.1 J17.1 LED6.A

## Sheet 6 of 6: Programation interface
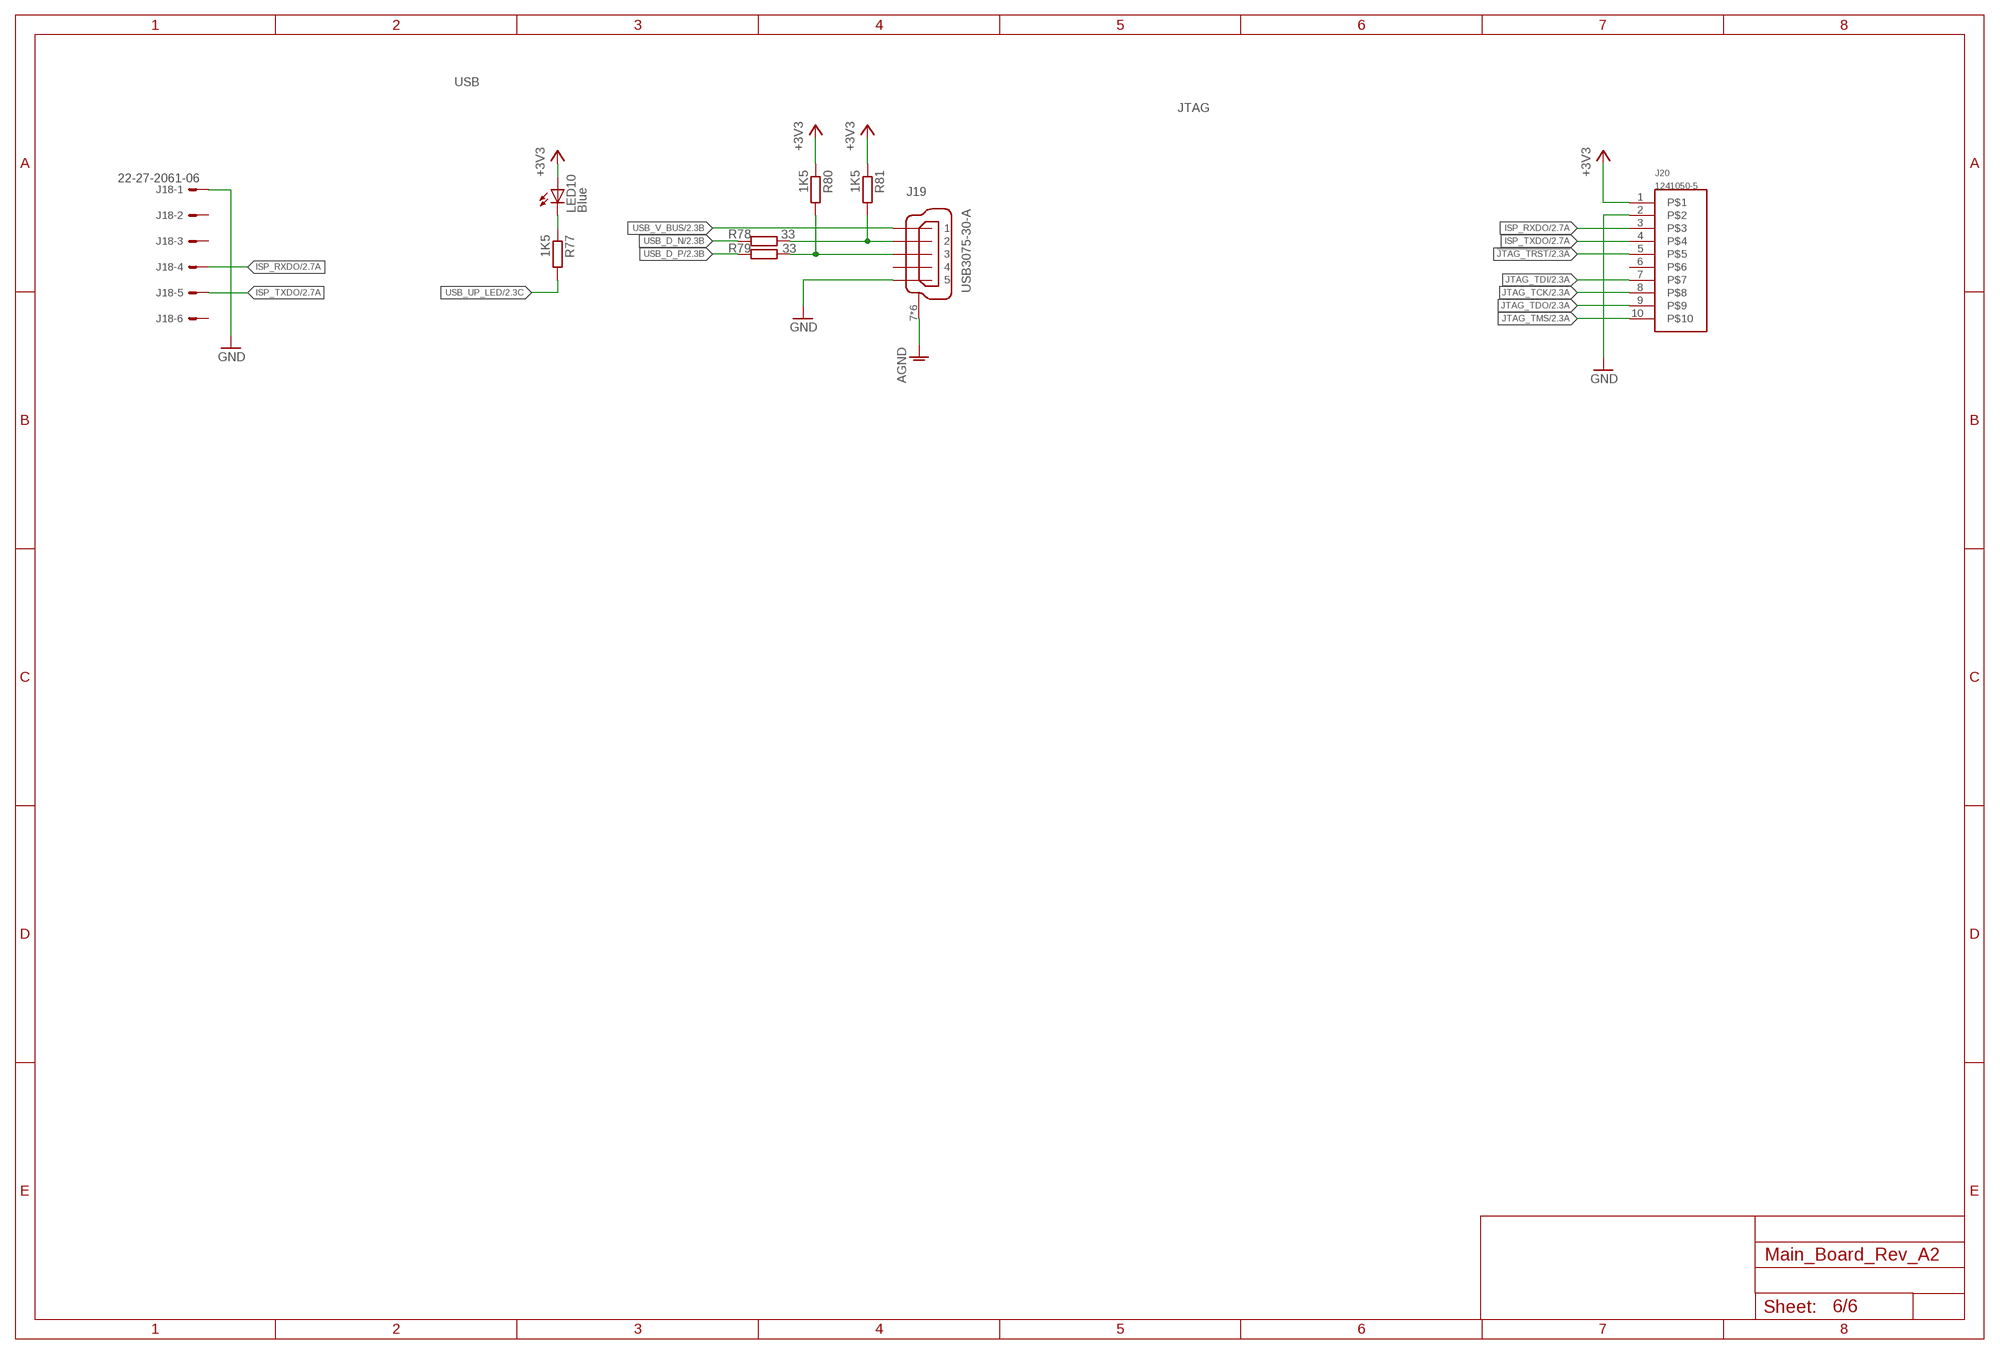
[diagram p5: schematic, sheet 6]

### Parts
J18  22-27-2061-06  [6410-06]
J19  USB3075-30-A  [USB_MICROB_SMT]
J20  1241050-5  [2.54/2X5]
LED10  Blue  LEDCHIPLED_0603  [CHIPLED_0603]
R77  1K5  R-EU_R0603  [R0603]
R78  33  R-EU_R0603  [R0603]
R79  33  R-EU_R0603  [R0603]
R80  1K5  R-EU_R0603  [R0603]
R81  1K5  R-EU_R0603  [R0603]

### Nets
!JTAG_TRST: J20.5 ; also sheet 2
+3V3 [supply]: J20.1 LED10.A R80.1 R81.1 ; also sheet 1,2,3,4,5
AGND: J19.7(S) J19.8(S) J19.9(S) J19.10(S) J19.11(S) J19.12(S) ; also sheet 1,3,5
GND [supply]: J18.1 J19.5 J20.2 ; also sheet 1,2,3,4,5
ISP_RXDO [signal]: J18.4 J20.3 ; also sheet 2
ISP_TXDO [signal]: J18.5 J20.4 ; also sheet 2
JTAG_TCK [signal]: J20.8 ; also sheet 2
JTAG_TDI [signal]: J20.7 ; also sheet 2
JTAG_TDO [signal]: J20.9 ; also sheet 2
JTAG_TMS [signal]: J20.10 ; also sheet 2
N$15 [signal]: J19.2 R78.1 R81.2
N$16 [signal]: J19.3 R79.1 R80.2
N$18 [signal]: LED10.C R77.1
USB_D_N: R78.2 ; also sheet 2
USB_D_P [signal]: R79.2 ; also sheet 2
USB_UP_LED [signal]: R77.2 ; also sheet 2
USB_V_BUS [signal]: J19.1 ; also sheet 2
Unconnected: J18.2 J18.3 J18.6 J19.4 J20.6

### Notes on the sheet
- USB
- JTAG

## Library data of the parts
C1 = rcl:CPOL-EU: POLARIZED CAPACITOR, European symbol; MPN: F931A475MAA; OC_NEWARK: 58R3271
C2 C3 C6-C8 C10-C14 = rcl:C-EU: CAPACITOR, European symbol; MPN: MC0603B104K250CT; OC_NEWARK: 06R4925
C4 C9 C15 = rcl:CPOL-EU: POLARIZED CAPACITOR, European symbol; MPN: F931A106MAA; OC_NEWARK: 58R3260
C5 = rcl:C-EU: CAPACITOR, European symbol; MPN: MC0603B472K500CT; OC_NEWARK: 33R0458
C16-C18 C20-C23 C25-C34 C37-C45 = rcl:C-EU: CAPACITOR, European symbol; MPN: MC0603B104K160CT; OC_NEWARK: 06R4923
C19 C24 = rcl:C-EU: CAPACITOR, European symbol; MPN: MC0603N180K500CT; OC_NEWARK: 06R5140
C35 C36 = rcl:C-EU: CAPACITOR, European symbol; MPN: MC0603X475K100CT; OC_NEWARK: 06X6198
C46 C47 C50 C51 = rcl:C-EU: CAPACITOR, European symbol; MPN: GRT188R61H225KE13D; OC_NEWARK: 01AC8938
C48 C49 = rcl:C-EU: CAPACITOR, European symbol; MPN: MC0603B102K500CT; OC_NEWARK: 06R4910
C52 C53 = rcl:C-EU: CAPACITOR, European symbol; MPN: MC0805X226M6R3CT; OC_NEWARK: 33R0743
D1 D2 = diode:MBRS140: Redresseur Schottky, 40 V, 1 A, Une, DO-214AA, 2 Broche(s), 600 mV; MF: ON SEMICONDUCTOR; MPN: MBRS140T3G; OC_NEWARK: 83H7272
F1 = fuse2:1812L; MPN: 3557; OC_NEWARK: 22M2711
J1 J12 J13 = con-molex:22-?-02: CONNECTOR wire to board 2.54 mm (.1 inch) pitch header; MPN: 22-05-7028; OC_FARNELL: 9731601; OC_NEWARK: 25M1728
J2 = con-wiznet:RB1-125BAG1A: Accessory RJ-45 With Transformer Connector - UDE; OC_NEWARK: unknown
J3 = con-multicomp:5504F1-09S-02A-03: D-Sub 9pts, Righ-angle, solder; MPN: 5504F1-09S-02A-03; OC_NEWARK: 18T0703
J4-J7 = con-molex:22-?-03: CONNECTOR wire to board 2.54 mm (.1 inch) pitch header; MPN: 22-05-7038; OC_FARNELL: 9731610; OC_NEWARK: 26M6362
J8 J11 = con-molex:22-?-05: CONNECTOR wire to board 2.54 mm (.1 inch) pitch header; MF: MOLEX; MPN: 22-05-7058; OC_FARNELL: unknown; OC_NEWARK: 55H9619
J9 J10 = con-molex:22-?-04: CONNECTOR wire to board 2.54 mm (.1 inch) pitch header; MPN: 22-05-7048; OC_FARNELL: unknown; OC_NEWARK: 26M6363
J14 J15 = Molex_By_element14_Batch_1:90814-0208: CONN HEADER 8POS 1.27MM SMD TIN; MPN: 90814-0208; OC_FARNELL: 1757025; OC_NEWARK: 34R6216; PACKAGE: CONN-8POS; SUPPLIER: Molex
J16 = Molex_By_element14_Batch_1:90814-0206: CONN HEADER 06 POS 1.27MM SMD TIN; MPN: 90814-0206; OC_FARNELL: 1757024; OC_NEWARK: 34R6215; PACKAGE: CONN-6 POS; SUPPLIER: Molex
J17 = con-phoenix-508:MSTBA2: PHOENIX; MF: FARNELL; MPN: 1757242; OC_FARNELL: 3705171; OC_NEWARK: 71C4161
J18 = con-molex:22-?-06: CONNECTOR wire to board 2.54 mm (.1 inch) pitch header; MF: MOLEX; MPN: 22-27-2061; OC_FARNELL: unknown; OC_NEWARK: 56H0719
J19 = con-GlobalConnectorTechnology:USB3075-30-A; MPN: USB3075-30-A; OC_NEWARK: 58T0863
J20 = con-amp:1241050-5; MPN: 1241050-5; OC_NEWARK: 98K5467
JP1-JP4 = SparkFun:FIDUCIAL: Fiducial Alignment Points Various fiducial points for machine vision alignment.; OC_NEWARK: unknown
K1-K4 = relay:G6K: Low Signal Relay oeiwcsnts1.omron.com/.. D20G6K0100.pdf; MF: OMRON COMPONENTS USA; MPN: G6K-2G-YDC24 BY OMR; OC_FARNELL: 4484794; OC_NEWARK: 17C6944
L1 = coilcraft:0603PS; OC_NEWARK: unknown
L2 = Wurth-POWER_MAGNETICS-rev16f:WE-PD2: SMD Power Inductor Characteristics Open size Saturation currents up to 14 A Low tolerances at high inductance values Operating temperature: –40 °C to +125 °C Applications Integrated DC/DC-converter Switching regulators with low operating voltages (Graphic cards, embedded PC-Cards, Mainboards) Optimal attenuation in MHz frequency range Details see: http://katalog.we-online.de/en/pbs/WE-PD2 Updated by Dan Xu 2014-07-08 2014 (C) Wurth Elektronik; MPN: 744774115; OC_NEWARK: 08P2818
L3 = Wurth-POWER_MAGNETICS-rev16f:WE-PD2: SMD Power Inductor Characteristics Open size Saturation currents up to 14 A Low tolerances at high inductance values Operating temperature: –40 °C to +125 °C Applications Integrated DC/DC-converter Switching regulators with low operating voltages (Graphic cards, embedded PC-Cards, Mainboards) Optimal attenuation in MHz frequency range Details see: http://katalog.we-online.de/en/pbs/WE-PD2 Updated by Dan Xu 2014-07-08 2014 (C) Wurth Elektronik; MPN: 74477410; OC_NEWARK: 08P2817
LED1-LED5 LED7-LED10 = led:LED: LED OSRAM: - CHIPLED LG R971, LG N971, LY N971, LG Q971, LY Q971, LO R971, LY R971 LH N974, LH R974 LS Q976, LO Q976, LY Q976 LO Q996 - Hyper CHIPLED LW Q18S LB Q993, LB Q99A, LB R99A - SideLED LS A670, LO A670, LY A670, LG A670, LP A670 LB A673, LV A673, LT A673, LW A673 LH A674 LY A675 LS A676, LA A676, LO A676, LY A676, LW A676 LS A679, LY A679, LG A679 - Hyper Micro SIDELED® LS Y876, LA Y876, LO Y876, LY Y876 LT Y87S - SmartLED LW L88C, LW L88S LB L89C, LB L89S, LG L890 LS L89K, LO L89K, LY L89K LS L896, LA L896, LO L896, LY L896 - TOPLED LS T670, LO T670, LY T670, LG T670, LP T670 LSG T670, LSP T670, LSY T670, LOP T670, LYG T670 LG T671, LOG T671, LSG T671 LB T673, LV T673, LT T673, LW T673 LH T674 LS T676, LA T676, LO T676, LY T676, LB T676, LH T676, LSB T676, LW T676 LB T67C, LV T67C, LT T67C, LS T67K, LO T67K, LY T67K, LW E67C LS E67B, LA E67B, LO E67B, LY E67B, LB E67C, LV E67C, LT E67C LW T67C LS T679, LY T679, LG T679 LS T770, LO T770, LY T770, LG T770, LP T770 LB T773, LV T773, LT T773, LW T773 LH T774 LS E675, LA E675, LY E675, LS T675 LS T776, LA T776, LO T776, LY T776, LB T776 LHGB T686 LT T68C, LB T68C - Hyper Mini TOPLED® LB M676 - Mini TOPLED Santana® LG M470 LS M47K, LO M47K, LY M47K Source: http://www.osram.convergy.de LUXEON: - LUMILED® LXK2-PW12-R00, LXK2-PW12-S00, LXK2-PW14-U00, LXK2-PW14-V00 LXK2-PM12-R00, LXK2-PM12-S00, LXK2-PM14-U00 LXK2-PE12-Q00, LXK2-PE12-R00, LXK2-PE12-S00, LXK2-PE14-T00, LXK2-PE14-U00 LXK2-PB12-K00, LXK2-PB12-L00, LXK2-PB12-M00, LXK2-PB14-N00, LXK2-PB14-P00, LXK2-PB14-Q00 LXK2-PR12-L00, LXK2-PR12-M00, LXK2-PR14-Q00, LXK2-PR14-R00 LXK2-PD12-Q00, LXK2-PD12-R00, LXK2-PD12-S00 LXK2-PH12-R00, LXK2-PH12-S00 LXK2-PL12-P00, LXK2-PL12-Q00, LXK2-PL12-R00 Source: www.luxeon.com KINGBRIGHT: KA-3528ASYC Source: www.kingbright.com; MPN: OVS-0603; OC_NEWARK: 15R2205
LED6 = led:LED: LED OSRAM: - CHIPLED LG R971, LG N971, LY N971, LG Q971, LY Q971, LO R971, LY R971 LH N974, LH R974 LS Q976, LO Q976, LY Q976 LO Q996 - Hyper CHIPLED LW Q18S LB Q993, LB Q99A, LB R99A - SideLED LS A670, LO A670, LY A670, LG A670, LP A670 LB A673, LV A673, LT A673, LW A673 LH A674 LY A675 LS A676, LA A676, LO A676, LY A676, LW A676 LS A679, LY A679, LG A679 - Hyper Micro SIDELED® LS Y876, LA Y876, LO Y876, LY Y876 LT Y87S - SmartLED LW L88C, LW L88S LB L89C, LB L89S, LG L890 LS L89K, LO L89K, LY L89K LS L896, LA L896, LO L896, LY L896 - TOPLED LS T670, LO T670, LY T670, LG T670, LP T670 LSG T670, LSP T670, LSY T670, LOP T670, LYG T670 LG T671, LOG T671, LSG T671 LB T673, LV T673, LT T673, LW T673 LH T674 LS T676, LA T676, LO T676, LY T676, LB T676, LH T676, LSB T676, LW T676 LB T67C, LV T67C, LT T67C, LS T67K, LO T67K, LY T67K, LW E67C LS E67B, LA E67B, LO E67B, LY E67B, LB E67C, LV E67C, LT E67C LW T67C LS T679, LY T679, LG T679 LS T770, LO T770, LY T770, LG T770, LP T770 LB T773, LV T773, LT T773, LW T773 LH T774 LS E675, LA E675, LY E675, LS T675 LS T776, LA T776, LO T776, LY T776, LB T776 LHGB T686 LT T68C, LB T68C - Hyper Mini TOPLED® LB M676 - Mini TOPLED Santana® LG M470 LS M47K, LO M47K, LY M47K Source: http://www.osram.convergy.de LUXEON: - LUMILED® LXK2-PW12-R00, LXK2-PW12-S00, LXK2-PW14-U00, LXK2-PW14-V00 LXK2-PM12-R00, LXK2-PM12-S00, LXK2-PM14-U00 LXK2-PE12-Q00, LXK2-PE12-R00, LXK2-PE12-S00, LXK2-PE14-T00, LXK2-PE14-U00 LXK2-PB12-K00, LXK2-PB12-L00, LXK2-PB12-M00, LXK2-PB14-N00, LXK2-PB14-P00, LXK2-PB14-Q00 LXK2-PR12-L00, LXK2-PR12-M00, LXK2-PR14-Q00, LXK2-PR14-R00 LXK2-PD12-Q00, LXK2-PD12-R00, LXK2-PD12-S00 LXK2-PH12-R00, LXK2-PH12-S00 LXK2-PL12-P00, LXK2-PL12-Q00, LXK2-PL12-R00 Source: www.luxeon.com KINGBRIGHT: KA-3528ASYC Source: www.kingbright.com; MPN: OVS-0608; OC_NEWARK: 15R2208
MP1-MP4 = holes:MOUNT-PAD: MOUNTING HOLE with drill center marker; OC_NEWARK: unknown
R1 R2 = rcl:R-EU_: RESISTOR, European symbol; MPN: MCMR06X2200FTL; OC_NEWARK: 86T3577
R3-R6 = rcl:R-EU_: RESISTOR, European symbol; MPN: MCMR06X49R9FTL; OC_NEWARK: 86T3659
R7 R8 R25 R26 = rcl:R-EU_: RESISTOR, European symbol; MPN: MCMR06X60R4FTL; OC_NEWARK: 86T3680
R9 R12 R13 R28 R29 R31 R32 R57 R58 R69 R70 = rcl:R-EU_: RESISTOR, European symbol; MPN: MCMR06X4701FTL; OC_NEWARK: 86T3649
R10 = rcl:R-EU_: RESISTOR, European symbol; MPN: MCMR06X2201FTL; OC_NEWARK: 86T3578
R11 R16 R17 R49-R52 = rcl:R-EU_: RESISTOR, European symbol; MPN: MCMR06X1002FTL; OC_NEWARK: 86T3506
R14 R15 R18 R19 = rcl:R-EU_: RESISTOR, European symbol; MPN: MCMR06X000 PTL; OC_NEWARK: 86T3500
R20 R35 R36 R38 R39 R77 R80 R81 = rcl:R-EU_: RESISTOR, European symbol; MPN: MCMR06X1501FTL; OC_NEWARK: 86T3542
R21-R24 R33 R34 R37 R40 R53-R56 R65 R66 = rcl:R-EU_: RESISTOR, European symbol; MPN: MCMR06X1000FTL; OC_NEWARK: 86T3504
R27 R30 = rcl:R-EU_: RESISTOR, European symbol; MPN: CRCW0603374KFKEA.; OC_NEWARK: 27W4235
R41 R42 R46-R48 R59-R64 = rcl:R-EU_: RESISTOR, European symbol; MPN: MCMR06X1001FTL; OC_NEWARK: 86T3505
R43-R45 = rcl:R-EU_: RESISTOR, European symbol; MPN: MCMR06X2701FTL; OC_NEWARK: 86T3598
R67 R68 R73 = rcl:R-EU_: RESISTOR, European symbol; MPN: MC0603SAF3162T5E; OC_FARNELL: 2073391; OC_NEWARK: 79M5962
R71 = rcl:R-EU_: RESISTOR, European symbol; MPN: MC0063W0603152K3; OC_FARNELL: 2073391; OC_NEWARK: 26M0962
R72 R74 = rcl:R-EU_: RESISTOR, European symbol; MPN: MCMR06X1002FTL; OC_FARNELL: 2073391; OC_NEWARK: 86T3506
R75 R76 = rcl:R-EU_: RESISTOR, European symbol; MPN: MCMR06X1501FTL; OC_FARNELL: 2073391; OC_NEWARK: 86T3542
R78 R79 = rcl:R-EU_: RESISTOR, European symbol; MPN: MCMR06X33R0FTL; OC_NEWARK: 86T3614
SW1 SW2 = Switch_SMT:B3FS: Surface-mounting Switches Ideal for High-density Mounting; MF: FARNELL; MPN: B3FS-1050; OC_NEWARK: 18J2451
T1 = exmachina:EXMACHINA-LOGO; OC_NEWARK: unknown
T2 = transistor:MMBT2222AL: General Purpose Transistors; MPN: MMBT2222ALT3G; OC_NEWARK: 10N9478
TP1 TP3 TP4 TP6 = testpad:TP: Test pad; OC_NEWARK: unknown
TP2 TP5 = testpad:TP: Test pad; OC_FARNELL: unknown; OC_NEWARK: unknown
U1 = textas:DP83848JSQ/NOPB; COPYRIGHT: Copyright C 2015 Accelerated Designs. All rights reserved; MANUFACTURER_PART_NUMBER: dp83848jsqnopb; MPN: DP83848JSQ/NOPB; OC_NEWARK: 96W2841; VENDOR: National Semiconductor
U2 = Microchip_By_element14_Batch_1:MCP2561-E/SN: High-Speed CAN Transceiver; MPN: MCP2561-E/SN; OC_NEWARK: 12X8698; PACKAGE: SOIC-8; SUPPLIER: Microchip
U3 = atmel:AT24C512C-SSHM-B: SERIAL EEPROM IC Memory Size:512Kbit,8-SOIC; MPN: AT24C512C-SSHM-B; OC_FARNELL: 1971995; OC_NEWARK: 68T4128; PACKAGE: 8SOIC; SUPPLIER: ATMEL
U4 = NXP:LPC1768FBD100; COPYRIGHT: Copyright C 2015 Accelerated Designs. All rights reserved; MANUFACTURER_PART_NUMBER: lpc1768fbd100; MPN: LPC1768FBD100; OC_NEWARK: 15R1840; VENDOR: NXP
U5 = ti:TLV313; MPN: TLV313IDBVT; OC_NEWARK: 95Y0395
U6 U7 = ti:SN74LVC2G17DBVR: DUAL SCHMITT-TRIGGER BUFFER; MF: TEXAS INSTRUMENTS; MPN: SN74LVC2G17DBVR; OC_FARNELL: 1470776; OC_NEWARK: 76C4207; PACKAGE: SOT-23-6; SUPPLIER: Texas Instruments
U8-U10 = ti:SN74LVC3G17DCTR: TRIPLE SCHMITT-TRIGGER BUFFER; MF: TEXAS INSTRUMENTS; MPN: SN74LVC3G17DCTR; OC_FARNELL: 1236391; OC_NEWARK: 90H3713; PACKAGE: SSOP-8; SUPPLIER: Texas Instruments
U11 = ti:TPL0401; MPN: ISL90727WIE627Z-T7A; OC_NEWARK: 82Y6761
U12 U13 = lineartechnology:LT3686HDDPBF: 37V/1.2A Step-DownRegulator in 3mm × 3mm DFN; MPN: LT3686HDD#PBF; OC_FARNELL: 2294943; OC_NEWARK: 78R8986; PACKAGE: DFN-10; SUPPLIER: Linear Technology
X1 = crystal:ASE: 3.3Vdc CMOS SMD CRYSTAL CLOCK OSCILLATOR SOurce: www.abracon.com; MPN: ASE-50.000MHZ-LC-T; OC_FARNELL: unknown; OC_NEWARK: 84R2105
X2 = crystal:FC-135: 32.768kHz ±20ppm Crystal 12.5pF 70 kOhm -40°C ~ 85°C Surface Mount 2-SMD; MPN: Q13FC13500004; OC_NEWARK: 31M4970
X3 = crystal:ASE: 3.3Vdc CMOS SMD CRYSTAL CLOCK OSCILLATOR SOurce: www.abracon.com; MPN: ASE-12.000MHZ-LC-T; OC_FARNELL: unknown; OC_NEWARK: 40Y2118
X4 = keystone:3000; MF: KEYSTONE ELECTR; MPN: 3000; OC_NEWARK: 66F5622

## Net classes
1 signal: width 0.178 mm, drill 0.35 mm
2 supply: width 0.008 mm, drill 0.5 mm